# Altium schematic sheet main.SchDoc
size A4; Organization: Altium Limited; Address1: 3 Minna Close; Address2: Belrose; Address3: NSW 2085; Address4: Australia; DocumentNumber: 1; SheetNumber: 1; SheetTotal: 4
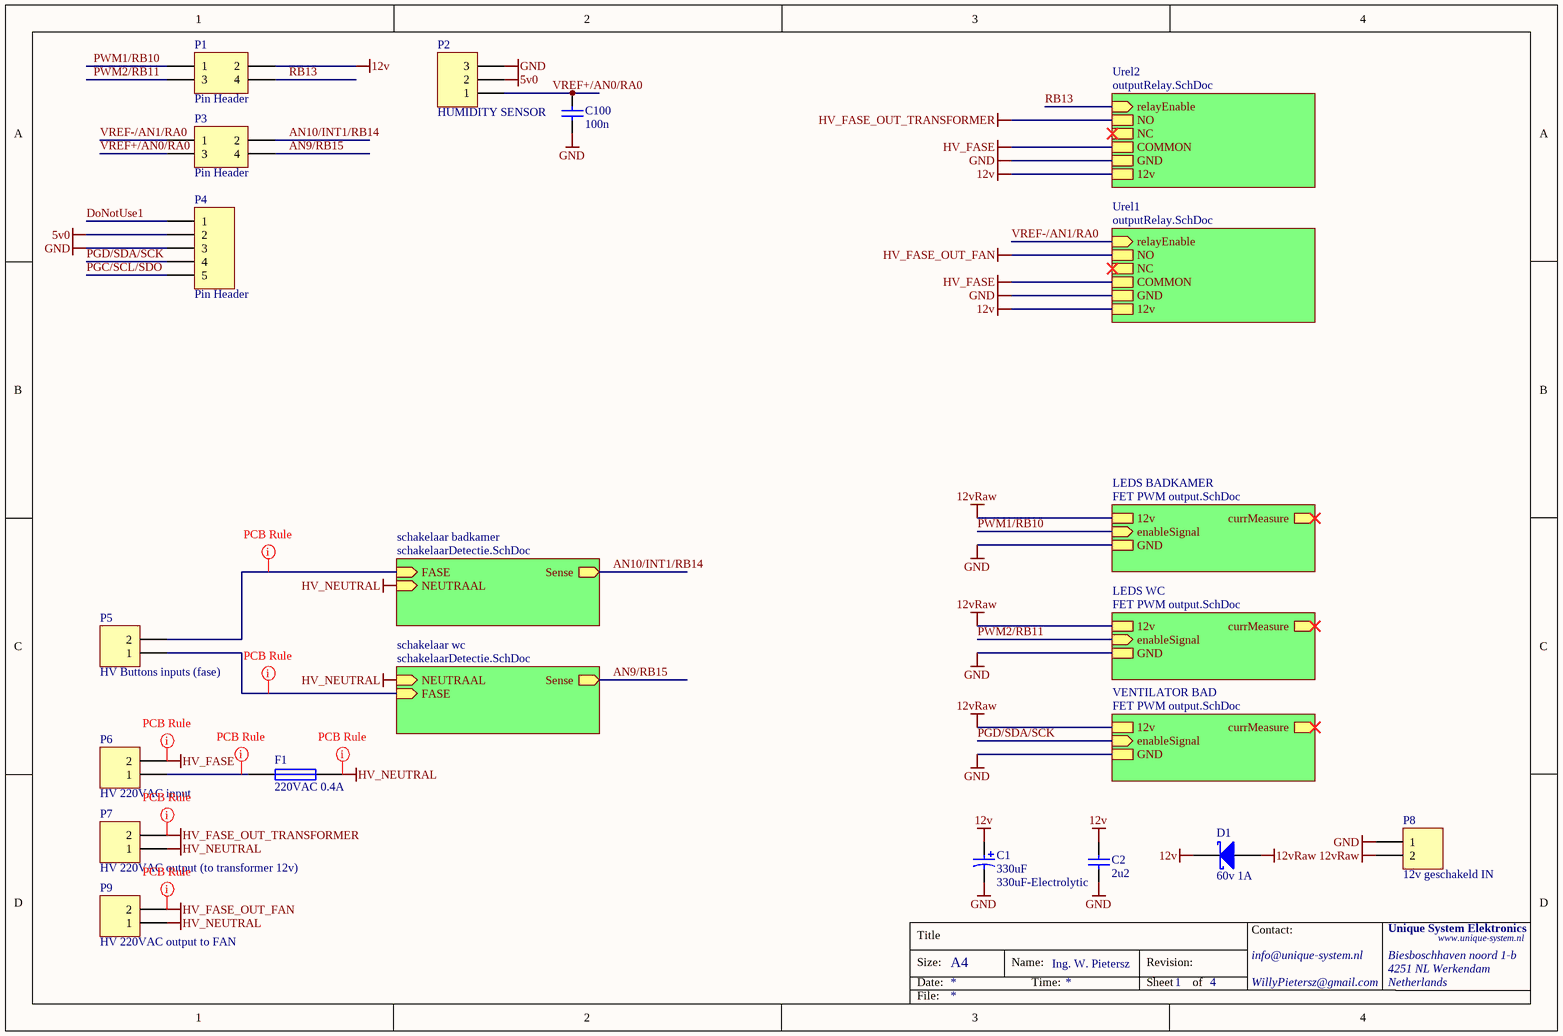
[diagram p0: main.SchDoc]

## Parts
C1  330uF  Part Number: 330uF-Electrolytic  [SMT CASE G]
C2  2u2  [C0805]
C100  100n  [C0805]
D1  60v 1A  [SOD323]
F1  220VAC 0.4A  [Rachem_R8]
P1  Pin Header  [HDR2X2-SMT-1.27]
P2  HUMIDITY SENSOR  [TB3_3.5]
P3  Pin Header  [HDR2X2-SMT-1.27]
P4  Pin Header  [HDR1X5 SMT]
P5  HV Buttons inputs (fase)  [TB2_5.08]
P6  HV 220VAC input  [TB2_5.08]
P7  HV 220VAC output (to transformer 12v)  [TB2_5.08]
P8  12v geschakeld IN  [TB2_5.08]
P9  HV 220VAC output to FAN  [TB2_5.08]

## Sub-sheets
LEDS BADKAMER = FET PWM output.SchDoc: 12v, enableSignal (in), currMeasure (out), GND
LEDS WC = FET PWM output.SchDoc: 12v, enableSignal (in), currMeasure (out), GND
schakelaar badkamer = schakelaarDetectie.SchDoc: FASE (in), NEUTRAAL (in), Sense (out)
schakelaar wc = schakelaarDetectie.SchDoc: FASE (in), NEUTRAAL (in), Sense (out)
Urel1 = outputRelay.SchDoc: relayEnable (in), NO, NC, COMMON, GND, 12v
Urel2 = outputRelay.SchDoc: relayEnable (in), NO, NC, COMMON, GND, 12v
VENTILATOR BAD = FET PWM output.SchDoc: 12v, enableSignal (in), currMeasure (out), GND

## Nets
5v0: P2.2 P4.2
12v: C1.2 C2.2 D1.2 P1.2 ; sheet Urel2/12v, sheet Urel1/12v
12vRaw: D1.1 P8.2 ; sheet LEDS BADKAMER/12v, sheet LEDS WC/12v, sheet VENTILATOR BAD/12v
GND: C1.1 C2.1 C100.1 P2.3 P4.3 P8.1 ; sheet Urel2/GND, sheet Urel1/GND, sheet LEDS BADKAMER/GND, sheet LEDS WC/GND, sheet VENTILATOR BAD/GND
HV_FASE: P6.2 ; sheet Urel2/COMMON, sheet Urel1/COMMON
HV_FASE_OUT_FAN: P9.2 ; sheet Urel1/NO
HV_FASE_OUT_TRANSFORMER: P7.2 ; sheet Urel2/NO
HV_NEUTRAL: F1.1 P7.1 P9.1 ; sheet schakelaar badkamer/NEUTRAAL, sheet schakelaar wc/NEUTRAAL
AN9/RB15: P3.4 ; sheet schakelaar wc/Sense
AN10/INT1/RB14: P3.2 ; sheet schakelaar badkamer/Sense
DoNotUse1: P4.1
PGC/SCL/SDO: P4.5
PGD/SDA/SCK: P4.4 ; sheet VENTILATOR BAD/enableSignal
PWM1/RB10: P1.1 ; sheet LEDS BADKAMER/enableSignal
PWM2/RB11: P1.3 ; sheet LEDS WC/enableSignal
RB13: P1.4 ; sheet Urel2/relayEnable
VREF+/AN0/RA0: C100.2 P2.1 P3.3
VREF-/AN1/RA0: P3.1 ; sheet Urel1/relayEnable
NetF1_2: F1.2 P6.1
NetP5_1: P5.1 ; sheet schakelaar wc/FASE
NetP5_2: P5.2 ; sheet schakelaar badkamer/FASE

## Layout directives
rule Clearance Constraint [Clearance = 2mm]: HV_FASE, HV_FASE_OUT_FAN, HV_FASE_OUT_TRANSFORMER, HV_NEUTRAL, NetF1_2, NetP5_1, NetP5_2

## Notes on the sheet
- Title
- Size:
- Date:
- A4
- Name:
- Time:
- Ing. W. Pietersz
- Revision:
- Sheet
- of
- WillyPietersz@gmail.com
- Contact:
- info@unique-system.nl
- Unique System Elektronics
- Biesboschhaven noord 1-b
- 4251 NL Werkendam
- Netherlands
- www.unique-system.nl
- File:

## Library data of the parts
C1 = 330uF-Electrolytic: Capacitor; Voltage: 35V; Tolerance: 0.2; Value: 330uF; Type: Electrolytic; Package: SMT CASE G; Component Type: Low ESR; LatestRevision Date: 14-Sep-10; Author: Willem Pietersz; Supplier 1: Farnell; Supplier Part Number 1: 9695885
C2 = 2u2: Voltage: 50; Type: generic; Tolerance: 0.1; LatestRevision Note: Initial Release; Part Number: 2u2; Value: 2u2; Package: 0805; Component Type: Standard; LatestRevision Date: 31-7-2010; Author: Willy Pietersz; Supplier 2: Digi-Key; ComponentLink1Description: Manufacturer; ComponentLink2Description: Datasheet
C100 = 100n: Voltage: 50v; Type: generic; Tolerance: 0.1; LatestRevision Note: Initial Release; Part Number: 100n; Value: 100n; Package: 0805; Component Type: Standard; LatestRevision Date: 31-Jul-10; Author: Willy Pietersz; Supplier 2: Digi-Key; Supplier Part Number 2: 478-1395-1-ND; ComponentLink1Description: Manufacturer; ComponentLink2Description: Datasheet
D1 = PMEG6010CEJ: LatestRevision Note: Initial Release; Part Number: PMEG6010CEJ; Voltage: 60V; Current: 1A; Type: Schottky; Package: SOD123F; Component Type: Standard; LatestRevision Date: 29-Sep-10 09:43:01; Author: Willem Pietersz; ROHS: Y; Supplier 1: Farnell; Supplier 2: Digi-key; Supplier Part Number 2: 568-4138-1-ND; ComponentLink2Description: Datasheet; ComponentLink2URL: http://www.nxp.com/documents/data_sheet/PMEG6010CEH_PMEG6010CEJ.pdf
F1 = LVR040K: Fuse; Published: 8-Jun-2000; LatestRevisionDate: 17-Jul-2002; LatestRevisionNote: Re-released for DXP Platform.; PackageReference: PIN-W2/E2.8; Publisher: Altium Limited; Part Number: LVR040K; Voltage: 220VAC; Current: 0.4A; Supplier 1: Farnell; Supplier Part Number 1: 1175836; ComponentLink1Description: Datasheet
P1 P3 = PH2x2-SMT-1.27: Header, 2-Pin, Dual row; Pitch: 1.27; Part Number: PH2x2-SMT-1.27; Type: Pin Header; Number Of Pins: 4; Component Type: Standard; Supplier 1: Digi-Key; Supplier Part Number 1: 609-3692-1-ND
P2 = TB3: Con1x3; Part Number: TB3; Current: 10; Voltage: 300; Pitch: 3,5; LatestRevision Note: Initial Release; Type: Terminal Block; Number Of Pins: 3; Component Type: Standard; LatestRevision Date: 23-Nov-10; Author: Willy Pietersz; Supplier 1: Farnell
P4 = PH1x5 SMT: Con1x5; Pitch: 2.54; Part Number: PH1x5 SMT; Number Of Pins: 5; Supplier 1: Farnell
P5-P9 = TB2: Con1x2; Part Number: TB2; Current: 10; Voltage: 300; Pitch: 5.08; LatestRevision Note: Initial Release; Type: Terminal Block; Number Of Pins: 2; Component Type: Standard; LatestRevision Date: 23-Nov-10; Author: Bram van Rensen